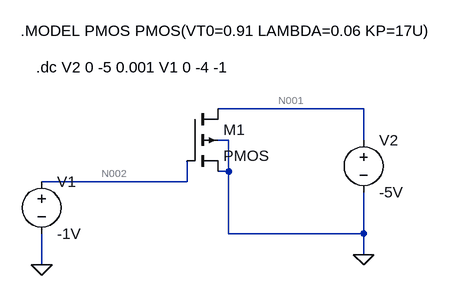
[diagram p0: schematic p_ch_MOSFET_L=5_W=10.asc]
p_ch_MOSFET_L=5_W=10.asc, the LTspice schematic file:
Version 4
SHEET 1 880 680
WIRE 448 128 224 128
WIRE 240 176 224 176
WIRE 448 176 448 128
WIRE 240 224 240 176
WIRE 240 224 224 224
WIRE 176 240 176 208
WIRE 176 240 -48 240
WIRE 240 320 240 224
WIRE 448 320 448 256
WIRE 448 320 240 320
WIRE 448 352 448 320
WIRE -48 368 -48 320
FLAG 448 352 0
FLAG -48 368 0
SYMBOL pmos4 176 128 R0
SYMATTR InstName M1
SYMATTR Value2 l=5um w=10um
SYMBOL voltage -48 224 R0
WINDOW 123 0 0 Left 2
WINDOW 39 0 0 Left 2
SYMATTR InstName V1
SYMATTR Value -1V
SYMBOL voltage 448 160 R0
WINDOW 123 0 0 Left 2
WINDOW 39 0 0 Left 2
SYMATTR InstName V2
SYMATTR Value -5V
TEXT -80 8 Left 2 !.MODEL PMOS PMOS(VT0=0.91 LAMBDA=0.06 KP=17U)
TEXT -56 64 Left 2 !.dc V2 0 -5 0.001 V1 0 -4 -1

The netlist it stands for:
* p_ch_MOSFET_L=5_W=10.asc
M1 N001 N002 0 0 PMOS l=5um w=10um
V1 N002 0 -1V
V2 N001 0 -5V
.model NMOS NMOS
.model PMOS PMOS
.lib standard.mos
.MODEL PMOS PMOS(VT0=0.91 LAMBDA=0.06 KP=17U)
.dc V2 0 -5 0.001 V1 0 -4 -1
.backanno
.end

* Results of the author's LTspice run, read from the files saved beside the schematic
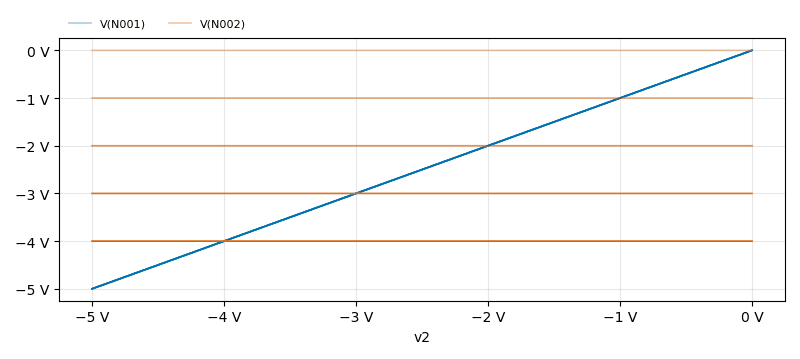
[diagram p1: DC transfer characteristic of p_ch_MOSFET_L=5_W=10.asc, plotted from the saved traces]
* DC transfer characteristic, 5 runs:
*   V(N001) [v1=0]: 0 V at v2=0 V, -5 V at v2=-5 V, min -5 V, max 0 V
*   V(N001) [v1=-1]: 0 V at v2=0 V, -5 V at v2=-5 V, min -5 V, max 0 V
*   V(N001) [v1=-2]: 0 V at v2=0 V, -5 V at v2=-5 V, min -5 V, max 0 V
*   V(N001) [v1=-3]: 0 V at v2=0 V, -5 V at v2=-5 V, min -5 V, max 0 V
*   V(N001) [v1=-4]: 0 V at v2=0 V, -5 V at v2=-5 V, min -5 V, max 0 V
*   V(N002) [v1=0]: 0 V at v2=0 V, 0 V at v2=-5 V, min 0 V, max 0 V
*   V(N002) [v1=-1]: -1 V at v2=0 V, -1 V at v2=-5 V, min -1 V, max -1 V
*   V(N002) [v1=-2]: -2 V at v2=0 V, -2 V at v2=-5 V, min -2 V, max -2 V
*   V(N002) [v1=-3]: -3 V at v2=0 V, -3 V at v2=-5 V, min -3 V, max -3 V
*   V(N002) [v1=-4]: -4 V at v2=0 V, -4 V at v2=-5 V, min -4 V, max -4 V